# Altium schematic sheet Power Amp.SchDoc
size A4
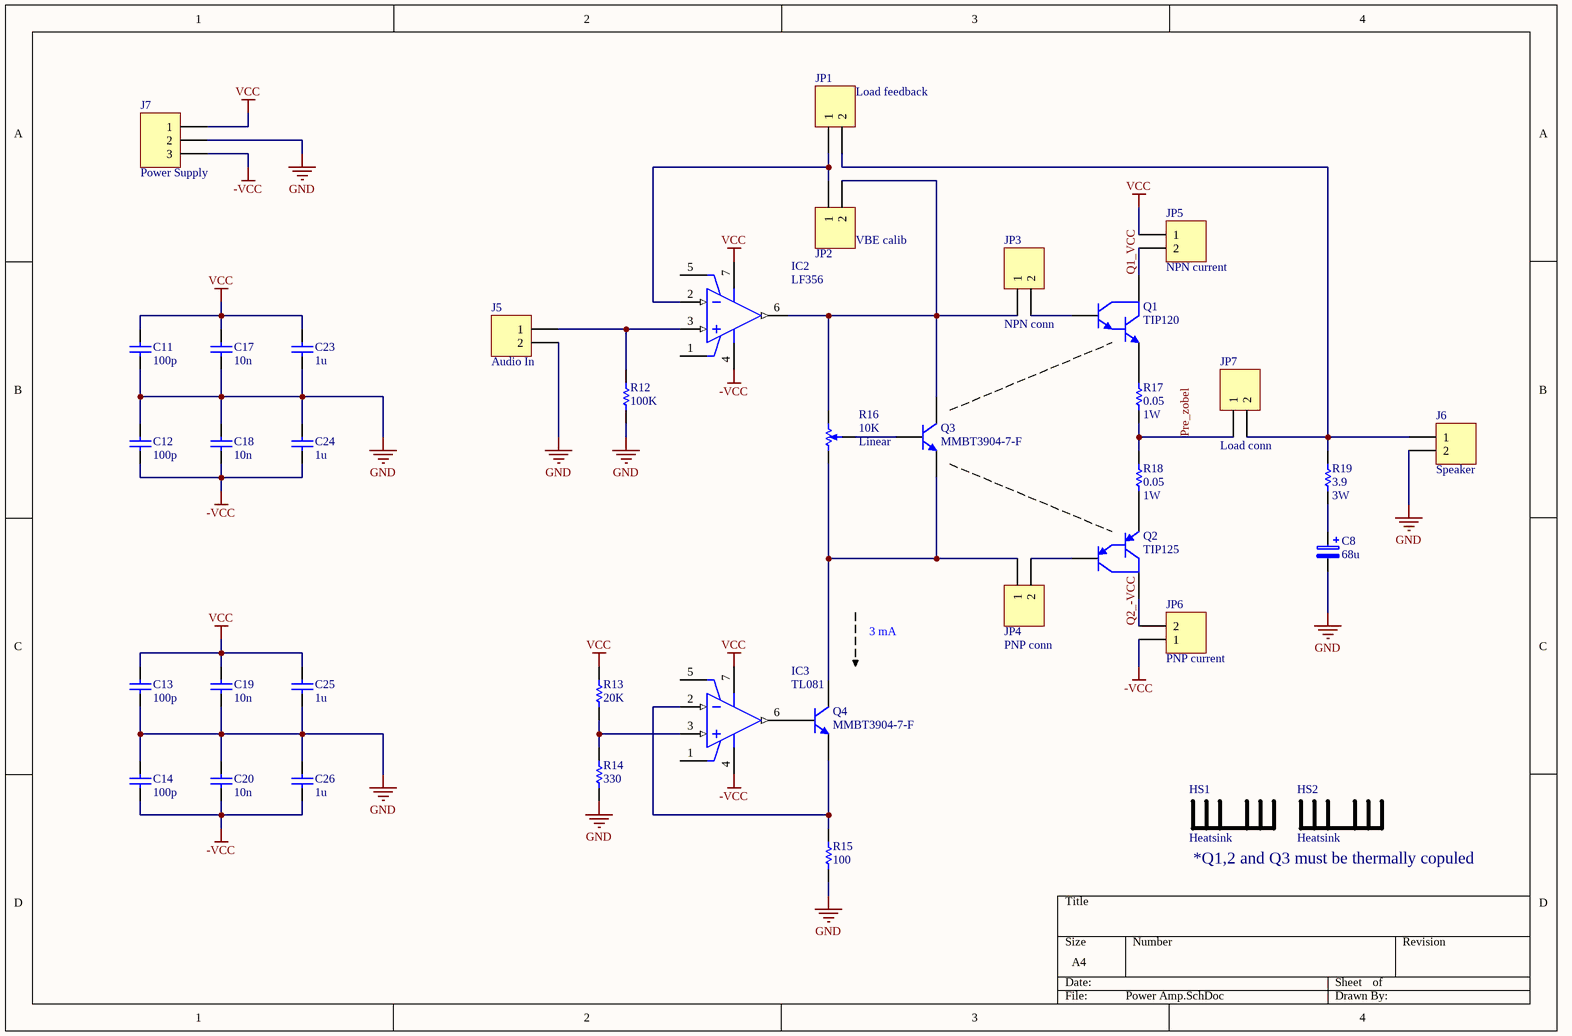
[diagram p0: Power Amp.SchDoc]

## Parts
C8  68u  [CRADIAL-2.5mm]
C11  100p  [C0805]
C12  100p  [C0805]
C13  100p  [C0805]
C14  100p  [C0805]
C17  10n  [C0805]
C18  10n  [C0805]
C19  10n  [C0805]
C20  10n  [C0805]
C23  1u  [C0805]
C24  1u  [C0805]
C25  1u  [C0805]
C26  1u  [C0805]
HS1  Heatsink  [MC33289]
HS2  Heatsink  [MC33289]
IC2  LF356  [SOIC127P600X175-8N]
IC3  TL081  [SOIC127P600X175-8N]
J5  Audio In  [2 Pin 5mm Terminal Block]
J6  Speaker  [2 Pin 5mm Terminal Block]
J7  Power Supply  [3 Pin 5mm Terminal Block]
JP1  Load feedback  [HDR1X2]
JP2  VBE calib  [HDR1X2]
JP3  NPN conn  [HDR1X2]
JP4  PNP conn  [HDR1X2]
JP5  NPN current  [HDR1X2]
JP6  PNP current  [HDR1X2]
JP7  Load conn  [HDR1X2]
Q1  TIP120  [TO-220]
Q2  TIP125  [TO-220]
Q3  MMBT3904-7-F  [SOT95P240X110-3N]
Q4  MMBT3904-7-F  [SOT95P240X110-3N]
R12  100K  [R0805]
R13  20K  [R0805]
R14  330  [R0805]
R15  100  [R0805]
R16  10K  Type: Linear  [Res Pot Square Trimm]
R17  0.05  Power: 1W  [R2512]
R18  0.05  Power: 1W  [R2512]
R19  3.9  Power: 3W  [RAXIAL-5mm-1mm]

## Nets
-VCC: C12.1 C14.1 C18.1 C20.1 C24.1 C26.1 IC2.4(V-) IC3.4(V-) J7.3 JP6.1
GND: C8.2 C11.1 C12.2 C13.1 C14.2 C17.1 C18.2 C19.1 C20.2 C23.1 C24.2 C25.1 C26.2 J5.2 J6.2 J7.2 R12.2 R14.1 R15.1
VCC: C11.2 C13.2 C17.2 C19.2 C23.2 C25.2 IC2.7(V+) IC3.7(V+) J7.1 JP5.1 R13.2
Pre_zobel: JP7.1 R17.1 R18.2
Q1_VCC: JP5.2 Q1.2(C)
Q2_-VCC: JP6.2 Q2.2(C)
NetC8_1: C8.1 R19.1
NetIC2_2: IC2.2(IN-) JP1.1 JP2.1
NetIC2_3: IC2.3(IN+) J5.1 R12.1
NetIC2_6: IC2.6(OUT) JP2.2 JP3.1 Q3.3(C) R16.1
NetIC3_2: IC3.2(IN-) Q4.2(E) R15.2
NetIC3_3: IC3.3(IN+) R13.1 R14.2
NetIC3_6: IC3.6(OUT) Q4.1(B)
NetJ6_1: J6.1 JP1.2 JP7.2 R19.2
NetJP3_2: JP3.2 Q1.1(B)
NetJP4_1: JP4.1 Q3.2(E) Q4.3(C) R16.3
NetJP4_2: JP4.2 Q2.1(B)
NetQ1_3: Q1.3(E) R17.2
NetQ2_3: Q2.3(E) R18.1
NetQ3_1: Q3.1(B) R16.2

Not connected (* = marked no-connect by the designer): IC2 1(BALANCE1) 5(BALANCE2); IC3 1(OFFSET_N1) 5(OFFSET_N2)

## Notes on the sheet
- 3 mA
- *Q1,2 and Q3 must be thermally copuled

## Library data of the parts
C8 = Pol Capacitor: Polarized Capacitor; Value: 68u
C11-C14 C17-C20 C23-C26 = Capacitor
  C11-C14: Value: 100p
  C17-C20: Value: 10n
  C23-C26: Value: 1u
HS1 = Heatsink (MC33289): Q1 Heatsink
HS2 = Heatsink (MC33289): Q2 Heatsink
J5 J6 = Terminal Block 2 Pin: Terminal Block, 2 Pin
J7 = Terminal Block 3 Pin: Terminal Block, 3 Pin
JP1-JP7 = Header 2: Header, 2-Pin
Q1 = TIP120/121/122: NPN Darlington Bipolar Transistor
Q2 = TIP125/126/127: PNP Darlington Bipolar Transistor
Q3 Q4 = MMBT3904-7-F: NPN General Purpose Amplifier SMD
R12-R15 R17-R19 = Resistor
  R12: Value: 100K
  R13: Value: 20K
  R14: Value: 330
  R15: Value: 100
  R17 R18: Value: 0.05
  R19: Value: 3.9
R16 = Res Pot: Square Trimming Potentiometer; Value: 10K